# Altium project 12D_MotorTest.PrjPcb
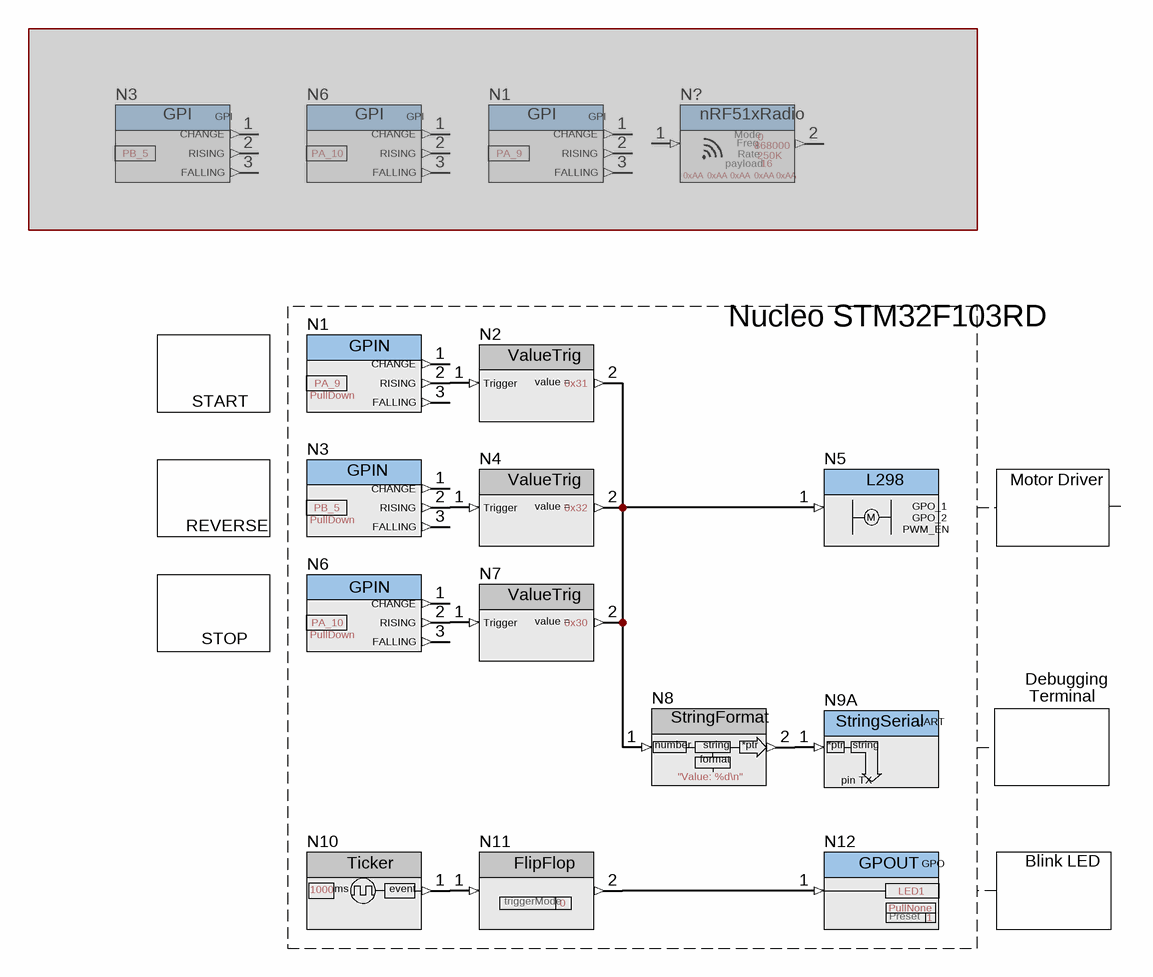
[diagram p0: 12D_MotorTest.SchDoc]
OrderQty: 8; prj: 12D_MotorTest
1 sheet, 16 parts. Net scope: hierarchical (ports join the sheet entries above them; power ports are global).

## Sheet 12D_MotorTest.SchDoc
size A4

### Parts
(Parts that share a designator on the sheet are numbered #1, #2 ... from top to bottom, then left to right.)
N1#1  GPI  nBlocksParameter1: PA_9  (masked out: inside a compile mask, not in the netlist)
N1#2  GPIN  nBlocksParameter2: PullDown  nBlocksParameter1: PA_9
N2  ValueTrig  nBlocksParameter1: 0x31
N3#1  GPI  nBlocksParameter1: PB_5  (masked out: inside a compile mask, not in the netlist)
N3#2  GPIN  nBlocksParameter2: PullDown  nBlocksParameter1: PB_5
N4  ValueTrig  nBlocksParameter1: 0x32
N5  L298
N6#1  GPI  nBlocksParameter1: PA_10  (masked out: inside a compile mask, not in the netlist)
N6#2  GPIN  nBlocksParameter2: PullDown  nBlocksParameter1: PA_10
N7  ValueTrig  nBlocksParameter1: 0x30
N8  StringFormat  nBlocksParameter1: "Value: %d\n"
N9  StringSerial  (part A of 2)
N10  Ticker  nBlocksParameter1: 1000
N11  FlipFlop  Parameter 1: triggerMode  nBlocksParameter1: 0
N12  GPOUT  nBlocksParameter1: LED1  Parameter 3: Preset  nBlocksParameter3: 1  nBlocksParameter2: PullNone
N?  nRF51xRadio  nBlocksParameter9: 0xAA  Parameter 2: Rate  Parameter 4: payload  Parameter 3: Freq  Parameter 1: Mode  nBlocksParameter1: 0  nBlocksParameter4: 16  nBlocksParameter2: 250K  nBlocksParameter3: 868000  (masked out: inside a compile mask, not in the netlist)

### Blocks framed on the sheet
Nucleo STM32F103RD: N1#2 N2 N3#2 N4 N5 N6#2 N7-N12

### Nets
NetN1#2_2: N1#2.2(RISING) N2.1(Trigger)
NetN2_2: N2.2(OUT) N4.2(OUT) N5.1(ValueIn) N7.2(OUT) N8.1(IN)
NetN3#2_2: N3#2.2(RISING) N4.1(Trigger)
NetN6#2_2: N6#2.2(RISING) N7.1(Trigger)
NetN8_2: N8.2(OUT) N9.1(TX)
NetN10_1: N10.1(OUT) N11.1(IN)
NetN11_2: N11.2 N12.1(IN)

Not connected (* = marked no-connect by the designer): N1#2 1(CHANGE) 3(FALLING); N3#2 1(CHANGE) 3(FALLING); N6#2 1(CHANGE) 3(FALLING)

### Notes on the sheet
- START
- REVERSE
- Motor Driver
- STOP
- Debugging
- Terminal
- Blink LED
- (in symbol NODE-GPOUT) GPO
- (in symbol NODE-L298) M; GPO_1; GPO_2; PWM_EN
- (in symbol NODE-STRINGFORMAT) number; string; *ptr; format
- (in symbol NODE-STRINGSERIAL-split, part A) UART; *ptr; string; pin TX
- (in symbol NODE-TICKER) ms; event
- (in symbol NODE-ValueTrig) value =

### Library data of the parts
N1#1 N3#1 N6#1 = NODE-GPI: General Purpose Input, with Change, Rising, Falling Outputs; Parameter 1: pinIn; ComponentLink1Description: link; ComponentLink1URL: https://github.com/nBlocksStudioNodes/nblocks_gpi
N1#2 N3#2 N6#2 = NODE-GPIN: This node is a **G**eneral **P**urpose **IN**nput : it passes the `pinIn` to the Node output variable with no changes, in the following frame. / The difference from GPI Node is / *  The `pinIn` mode is configurable with Parameter `modeString` as: / *  PullUp / *  PullDown / *  PullNone / *  OpenDrain / The underneath mbed API is `DigitalIn` / Based on GPI Node; Parameter 1: Pin; Parameter 2: PinMode; ComponentLink1Description: link; ComponentLink1URL: https://github.com/nblocksStudioNodes/nblocks_gpin
N2 N4 N7 = NODE-ValueTrig: when triggered outputs a preset Integer Value; Parameter 1: OutValue; ComponentLink1Description: link; ComponentLink1URL: https://github.com/nBlocksStudioNodes/nblocks_ValueTrig
N5 = NODE-L298: INA219 26V, 12-bit, i2c output current/voltage/power monitor API; Parameter 2: IN2; Parameter 1: IN1; Parameter 3: EN; nBlocksParameter3: PB_3; nBlocksParameter2: PA_8; nBlocksParameter1: PB_10; ComponentLink1Description: link; ComponentLink1URL: https://github.com/nBlocksStudioNodes/nblocks_l298
N8 = NODE-STRINGFORMAT: Parameter 1: formatString; ComponentLink1Description: link; ComponentLink1URL: https://github.com/nBlocksStudioNodes/nblocks_stringformat
N9 = NODE-STRINGSERIAL-split: StringSerial / This node implements a serial port, where characters received from the external world (RX pin) are sent one by one to the node's output, but the node's input expects a full string object as input (sent entirely within one frame to the TX pin). / DO NOT CONNECT integer data into this node, as it will definitely lead to incorrect behaviour, sending random bytes in unpredicted amount to the serial port. This can be harmful depending on your design.; nBlocksParameter2: USBRX; Parameter 2: pinRX; nBlocksParameter1: USBTX; Parameter 1: pinTX; ComponentLink1Description: link; ComponentLink1URL: https://github.com/nBlocksStudioNodes/nblocks_stringserial
N10 = NODE-TICKER: Creates a Periodical Event; ComponentLink1Description: link; ComponentLink1URL: https://github.com/nBlocksStudioNodes/nblocks_ticker
N11 = NODE-FLIPFLOP: [0] for (triggerMode_Positive) when the received value is > 0,        [1] for ( triggerMode_Zero), will toggle when received value = 0,  [2] for ( triggerMode_Both) it will toggle on any value; ComponentLink1Description: link; ComponentLink1URL: https://github.com/nBlocksStudioNodes/nblocks_flipflop
N12 = NODE-GPOUT: General Purpose Mcroprocessor Output, set modeString as: PullUp, PullDown, PullNone, OpenDrain; Parameter 1: pinOut; ComponentLink1Description: link; ComponentLink1URL: https://github.com/nBlocksStudioNodes/nblocks_gpout; Parameter 2: modeString
N? = NODE-nRF51xRadio: Mode 0=TX, 1=RX, 2=RxTx, Rate: 250k, 1M, 2M; Parameter 5: Address0; Parameter 6: Address1; Parameter 7: Address2; Parameter 8: Address3; Parameter 9: Address4; ComponentLink1Description: link; ComponentLink1URL: https://github.com/nBlocksStudioNodes/nblocks_nrf5xradio; nBlocksParameter8: 0xAA; nBlocksParameter7: 0xAA; nBlocksParameter6: 0xAA; nBlocksParameter5: 0xAA